# Altium schematic sheet LED.SchDoc
size A4
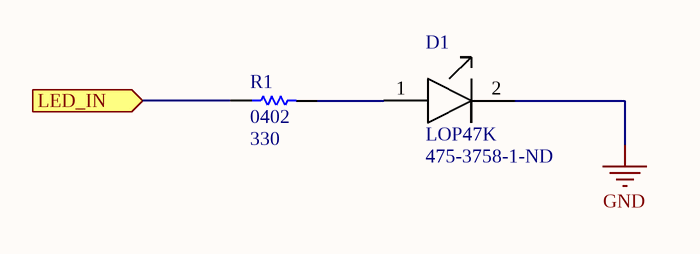
[diagram p0: LED.SchDoc]

## Parts
D1  LOP47K  Supplier Part Number 1: 475-3758-1-ND  [LB P4SG]
R1  0402  value 330  [RES0402R]

## Ports
LED_IN (in)

## Nets
GND: D1.2(Cathode)
LED_IN: R1.1 ; port LED_IN
NetD1_1: D1.1(Anode) R1.2

## Library data of the parts
D1 = LO P47K: LED ORANGE CLEAR SMD BOTTOM ENTRY; Supplier 1: Digi-Key
R1 = RES0402: 0402 resistor; Manufacturer: TE Connectivity; Manufacturer Part Number: CRGCQ0402F330R; Resistance: 330R; Tolerance: 1%; Max Power Dissipation: 63mW; Temperature Coefficient: 100ppm/°C; Supplier 1: Digi-Key; Supplier Part Number 1: A129621CT-ND; Stock 1: 224275; Pricing 1: 1=0.1, 10=0.022, 100=0.009, 1000=0.00406, 2500=0.00352, 5000=0.00291 (USD); Case/Package: 0402; Case Code (Imperial): 0402; Case Code (Metric): 1005; Min Operating Temperature: -55°C; Max Operating Temperature: 155°C; Composition: Thick Film; Features: Moisture Resistant,Automotive AEC-Q200; Packaging: Tape and Reel; Number of Terminations: 2